# Altium schematic sheet Sensores.SchDoc
size A4; SheetNumber: 3; SheetTotal: 4
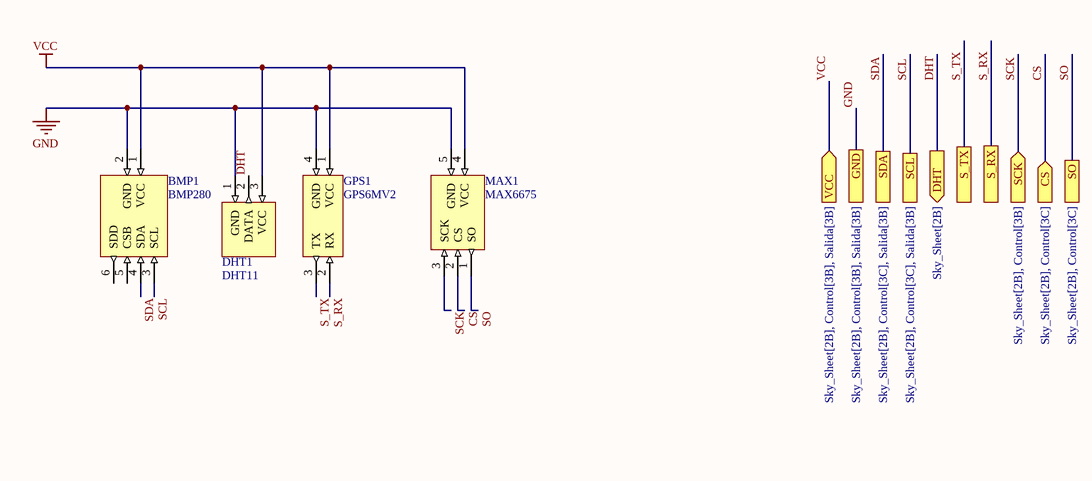
[diagram p0: Sensores.SchDoc]

## Parts
BMP1  BMP280  [BMP280]
DHT1  DHT11  [DHT11]
GPS1  GPS6MV2  [GPS]
MAX1  MAX6675  [MAX6675]

## Ports
CS (in, see Sky_Sheet[2B], Control[3C]), DHT (out, see Sky_Sheet[2B]), GND (see Sky_Sheet[2B], Control[3B], Salida[3B]), S_RX, S_TX, SCK (in, see Sky_Sheet[2B], Control[3B]), SCL (see Sky_Sheet[2B], Control[3C], Salida[3B]), SDA (see Sky_Sheet[2B], Control[3C], Salida[3B]), SO (see Sky_Sheet[2B], Control[3C]), VCC (in, see Sky_Sheet[2B], Control[3B], Salida[3B])

## Nets
GND: BMP1.2(GND) DHT1.1(GND) GPS1.4(GND) MAX1.5(GND) ; port GND
VCC: BMP1.1(VCC) DHT1.3(VCC) GPS1.1(VCC) MAX1.4(VCC) ; port VCC
CS: MAX1.2(CS) ; port CS
DHT: DHT1.2(DATA) ; port DHT
S_RX: GPS1.2(RX) ; port S_RX
S_TX: GPS1.3(TX) ; port S_TX
SCK: MAX1.3(SCK) ; port SCK
SCL: BMP1.3(SCL) ; port SCL
SDA: BMP1.4(SDA) ; port SDA
SO: MAX1.1(SO) ; port SO

Not connected (* = marked no-connect by the designer): BMP1 5(CSB) 6(SDD)